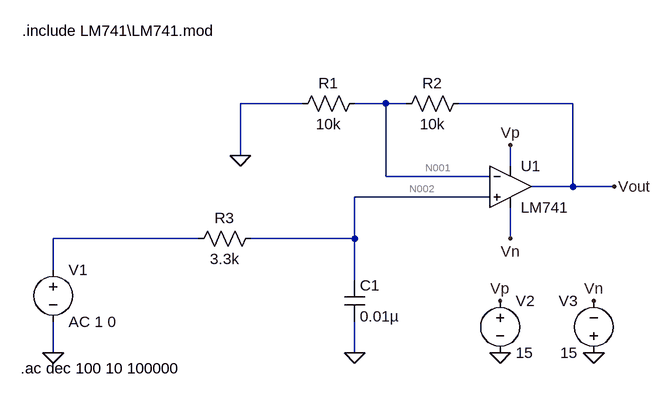
[diagram p0: schematic lpSK.asc]
lpSK.asc, the LTspice schematic file:
Version 4
SHEET 1 880 680
WIRE 80 80 -16 80
WIRE 208 80 160 80
WIRE 240 80 208 80
WIRE 496 80 320 80
WIRE -16 160 -16 80
WIRE 400 176 400 144
WIRE 208 192 208 80
WIRE 368 192 208 192
WIRE 496 208 496 80
WIRE 496 208 432 208
WIRE 560 208 496 208
WIRE 368 224 160 224
WIRE -80 288 -304 288
WIRE 160 288 160 224
WIRE 160 288 0 288
WIRE 400 288 400 240
WIRE -304 336 -304 288
WIRE 160 352 160 288
WIRE -304 464 -304 416
WIRE 160 464 160 416
FLAG 160 464 0
FLAG -304 464 0
FLAG -16 160 0
FLAG 560 208 Vout
FLAG 400 144 Vp
FLAG 400 288 Vn
FLAG 384 384 Vp
FLAG 528 384 Vn
FLAG 384 464 0
FLAG 528 464 0
SYMBOL res 176 64 R90
WINDOW 0 0 56 VBottom 2
WINDOW 3 32 56 VTop 2
SYMATTR InstName R1
SYMATTR Value 10k
SYMBOL res 336 64 R90
WINDOW 0 0 56 VBottom 2
WINDOW 3 32 56 VTop 2
SYMATTR InstName R2
SYMATTR Value 10k
SYMBOL res 16 272 R90
WINDOW 0 0 56 VBottom 2
WINDOW 3 32 56 VTop 2
SYMATTR InstName R3
SYMATTR Value 3.3k
SYMBOL cap 144 352 R0
SYMATTR InstName C1
SYMATTR Value 0.01µ
SYMBOL voltage -304 320 R0
WINDOW 123 0 0 Left 0
WINDOW 39 0 0 Left 0
SYMATTR InstName V1
SYMATTR Value AC 1 0
SYMBOL OpAmps\\opamp2 400 144 R0
SYMATTR InstName U1
SYMATTR Value LM741
SYMBOL voltage 384 368 R0
WINDOW 123 0 0 Left 0
WINDOW 39 0 0 Left 0
SYMATTR InstName V2
SYMATTR Value 15
SYMBOL voltage 528 480 R180
WINDOW 0 24 96 Left 2
WINDOW 3 24 16 Left 2
WINDOW 123 0 0 Left 0
WINDOW 39 0 0 Left 0
SYMATTR InstName V3
SYMATTR Value 15
TEXT -352 -32 Left 2 !.include LM741\\LM741.mod
TEXT -354 488 Left 2 !.ac dec 100 10 100000

The netlist it stands for:
* lpSK.asc
R1 N001 0 10k
R2 Vout N001 10k
R3 N002 N003 3.3k
C1 N002 0 0.01µ
V1 N003 0 AC 1 0
XU1 N002 N001 Vp Vn Vout LM741  ; pins In+ In- V+ V- OUT
V2 Vp 0 15
V3 0 Vn 15
.include LM741\LM741.mod
.ac dec 100 10 100000
.backanno
.end

* Results of the author's LTspice run, read from the files saved beside the schematic
* Operating Point, zero values left out:
*   V(n001) = 809.1 µV
*   V(vout) = 2.637 mV
*   V(n002) = -190.9 µV
*   V(vn) = -15 V
*   V(vp) = 15 V
*   I(R3) = -57.86 nA
*   I(R2) = 182.8 nA
*   I(R1) = 80.91 nA
*   I(V3) = -1.701 mA
*   I(V2) = -1.701 mA
*   I(V1) = -57.86 nA
*   Ix(u1:1) = 57.86 nA
*   Ix(u1:2) = 101.9 nA
*   Ix(u1:99) = 1.701 mA
*   Ix(u1:50) = -1.701 mA
*   Ix(u1:28) = -182.8 nA
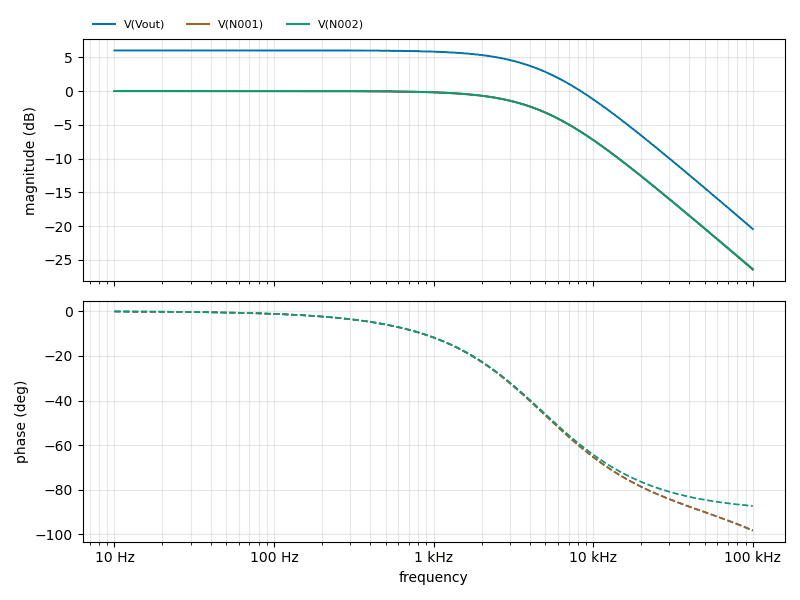
[diagram p1: AC Analysis of lpSK.asc, plotted from the saved traces]
* AC Analysis, 1 run:
*   V(Vout): 6.02 dB at 10 Hz, -20.42 dB at 100 kHz, peak 6.02 dB at 10 Hz, 3 dB below the peak at 4.822 kHz
*   V(N001): 0.00 dB at 10 Hz, -26.44 dB at 100 kHz, peak 0.00 dB at 10 Hz, 3 dB below the peak at 4.822 kHz
*   V(N002): -0.00 dB at 10 Hz, -26.34 dB at 100 kHz, peak -0.00 dB at 10 Hz, 3 dB below the peak at 4.822 kHz